# Altium schematic sheet TX_v5.SchDoc
size A
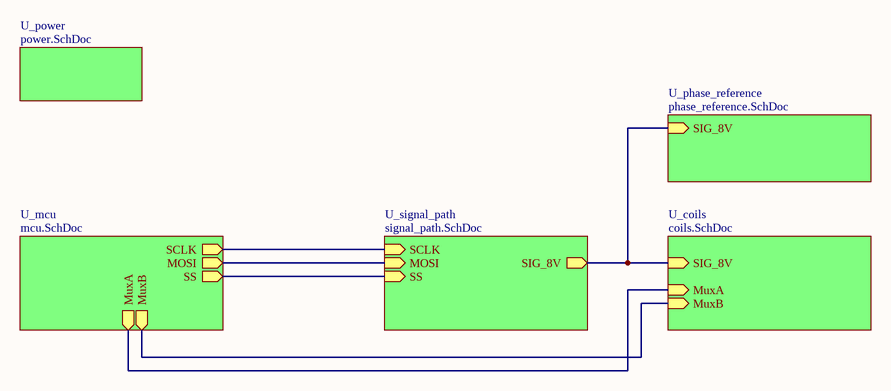
[diagram p0: TX_v5.SchDoc]

## Sub-sheets
U_coils = coils.SchDoc: MuxA (in), MuxB (in), SIG_8V (in)
U_mcu = mcu.SchDoc: SCLK (out), MuxB (out), MuxA (out), MOSI (out), SS (out)
U_phase_reference = phase_reference.SchDoc: SIG_8V (in)
U_power = power.SchDoc: no entries
U_signal_path = signal_path.SchDoc: SCLK (in), MOSI (in), SS (in), SIG_8V (out)

## Nets
(unnamed): sheet U_mcu/SCLK, sheet U_signal_path/SCLK
(unnamed): sheet U_mcu/MuxB, sheet U_coils/MuxB
(unnamed): sheet U_mcu/MuxA, sheet U_coils/MuxA
(unnamed): sheet U_mcu/MOSI, sheet U_signal_path/MOSI
(unnamed): sheet U_mcu/SS, sheet U_signal_path/SS
(unnamed): sheet U_signal_path/SIG_8V, sheet U_coils/SIG_8V, sheet U_phase_reference/SIG_8V